# Altium schematic sheet MotorControl_Sch.SchDoc
size B
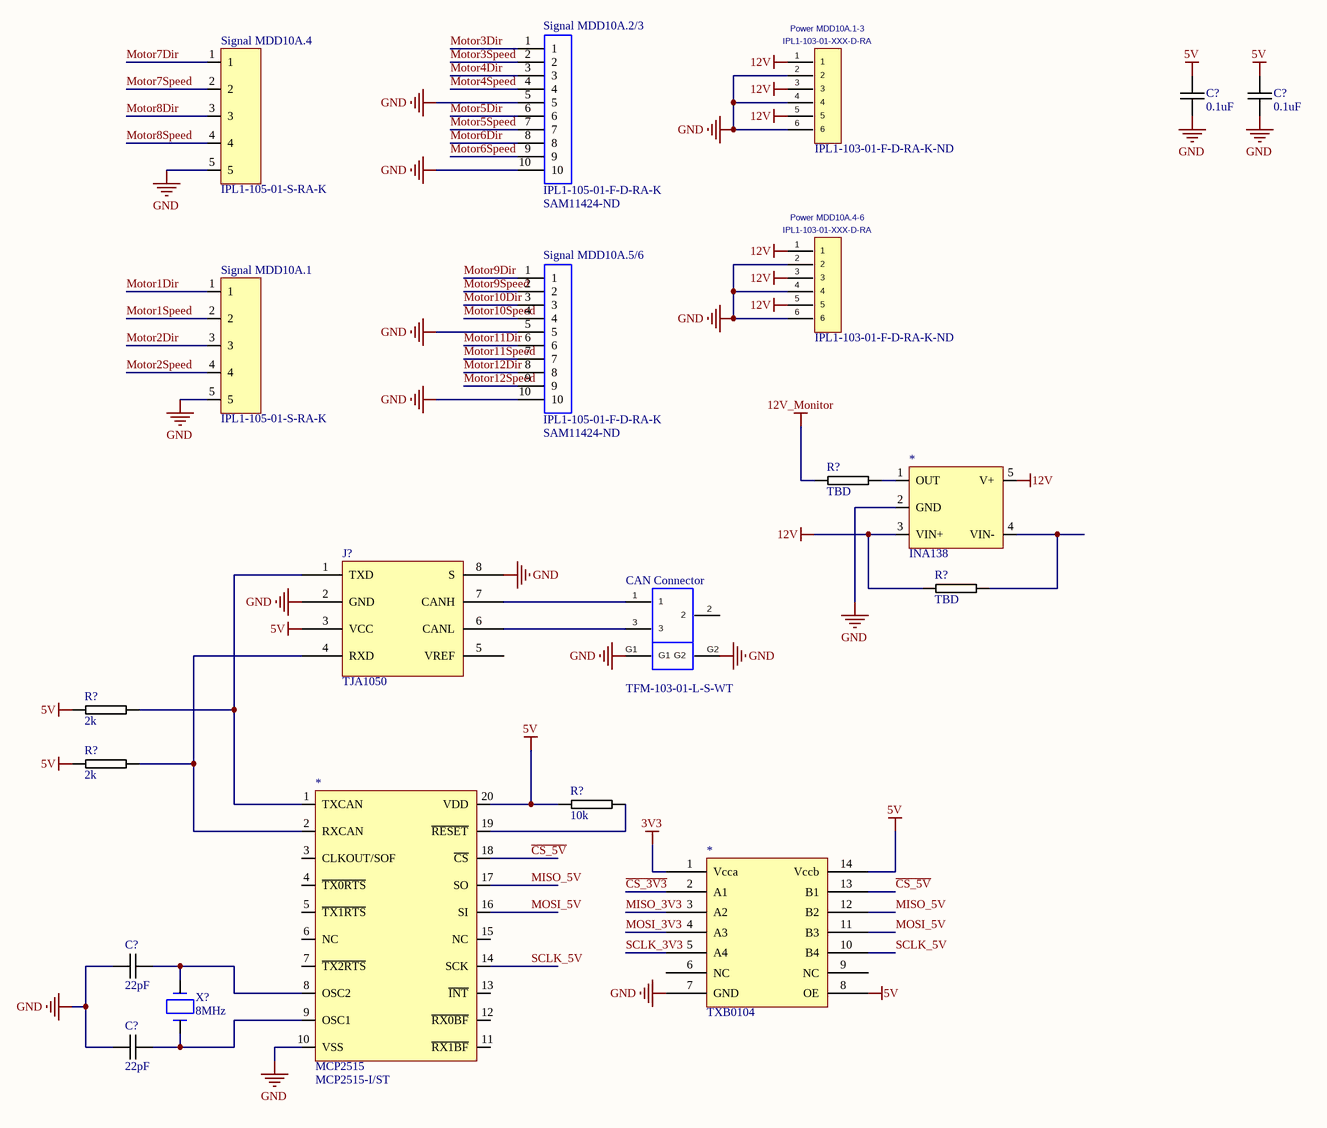
[diagram p0: MotorControl_Sch.SchDoc]

## Parts
(Parts that share a designator on the sheet are numbered #1, #2 ... from top to bottom, then left to right.)
*#1  INA138  [SOT23]
*#2  TXB0104  [TXB0104]
*#3  MCP2515  Supplier Part Number 1: MCP2515-I/ST  [TSSOP20]
C?#1  0.1uF  [0805C-GENERIC]
C?#2  0.1uF  [0805C-GENERIC]
C?#3  22pF  [0805C-GENERIC]
C?#4  22pF  [0805C-GENERIC]
CAN_Connector  TFM-103-01-L-S-WT  [TFM-103-01-L-S-WT]
J?  TJA1050  [TJA1050]
Power_MDD10A.1-3  IPL1-103-01-XXX-D-RA  Supplier Part Number 1: IPL1-103-01-F-D-RA-K-ND  [IPL1-103-01-XXX-D-RA]
Power_MDD10A.4-6  IPL1-103-01-XXX-D-RA  Supplier Part Number 1: IPL1-103-01-F-D-RA-K-ND  [IPL1-103-01-XXX-D-RA]
R?#1  TBD  [0805R-GENERIC]
R?#2  TBD  [0805R-GENERIC]
R?#3  2k  [0805R-GENERIC]
R?#4  2k  [0805R-GENERIC]
R?#5  10k  [0805R-GENERIC]
Signal_MDD10A.1  IPL1-105-01-S-RA-K  [IPL1-105-01-S-RA-K]
Signal_MDD10A.2/3  IPL1-105-01-F-D-RA-K  Supplier Part Number 1: SAM11424-ND  [IPL1-105-01-F-D-RA-K]
Signal_MDD10A.4  IPL1-105-01-S-RA-K  [IPL1-105-01-S-RA-K]
Signal_MDD10A.5/6  IPL1-105-01-F-D-RA-K  Supplier Part Number 1: SAM11424-ND  [IPL1-105-01-F-D-RA-K]
X?  8MHz  [GC0800044]

## Nets
3V3: *#2.1(Vcca)
5V: *#2.8(OE) *#2.14(Vccb) *#3.20(VDD) C?#1.1 C?#2.1 J?.3(VCC) R?#3.1 R?#4.1 R?#5.1
12V: *#1.3(VIN+) *#1.5(V+) Power_MDD10A.1-3.1 Power_MDD10A.1-3.3 Power_MDD10A.1-3.5 Power_MDD10A.4-6.1 Power_MDD10A.4-6.3 Power_MDD10A.4-6.5 R?#2.1
12V_Monitor: R?#1.1
GND: *#1.2(GND) *#2.7(GND) *#3.10(VSS) C?#1.2 C?#2.2 C?#3.1 C?#4.1 CAN_Connector.G1 CAN_Connector.G2 J?.2(GND) J?.8(S) Power_MDD10A.1-3.2 Power_MDD10A.1-3.4 Power_MDD10A.1-3.6 Power_MDD10A.4-6.2 Power_MDD10A.4-6.4 Power_MDD10A.4-6.6 Signal_MDD10A.1.5 Signal_MDD10A.2/3.5 Signal_MDD10A.2/3.10 Signal_MDD10A.4.5 Signal_MDD10A.5/6.5 Signal_MDD10A.5/6.10
~{CS_3V3}: *#2.2(A1)
~{CS_5V}: *#2.13(B1) *#3.18(~{CS})
MISO_3V3: *#2.3(A2)
MISO_5V: *#2.12(B2) *#3.17(SO)
MOSI_3V3: *#2.4(A3)
MOSI_5V: *#2.11(B3) *#3.16(SI)
Motor1Dir: Signal_MDD10A.1.1
Motor1Speed: Signal_MDD10A.1.2
Motor2Dir: Signal_MDD10A.1.3
Motor2Speed: Signal_MDD10A.1.4
Motor3Dir: Signal_MDD10A.2/3.1
Motor3Speed: Signal_MDD10A.2/3.2
Motor4Dir: Signal_MDD10A.2/3.3
Motor4Speed: Signal_MDD10A.2/3.4
Motor5Dir: Signal_MDD10A.2/3.6
Motor5Speed: Signal_MDD10A.2/3.7
Motor6Dir: Signal_MDD10A.2/3.8
Motor6Speed: Signal_MDD10A.2/3.9
Motor7Dir: Signal_MDD10A.4.1
Motor7Speed: Signal_MDD10A.4.2
Motor8Dir: Signal_MDD10A.4.3
Motor8Speed: Signal_MDD10A.4.4
Motor9Dir: Signal_MDD10A.5/6.1
Motor9Speed: Signal_MDD10A.5/6.2
Motor10Dir: Signal_MDD10A.5/6.3
Motor10Speed: Signal_MDD10A.5/6.4
Motor11Dir: Signal_MDD10A.5/6.6
Motor11Speed: Signal_MDD10A.5/6.7
Motor12Dir: Signal_MDD10A.5/6.8
Motor12Speed: Signal_MDD10A.5/6.9
SCLK_3V3: *#2.5(A4)
SCLK_5V: *#2.10(B4) *#3.14(SCK)
Net*#1_1: *#1.1(OUT) R?#1.2
Net*#1_4: *#1.4(VIN-) R?#2.2
Net*#3_1: *#3.1(TXCAN) J?.1(TXD) R?#3.2
Net*#3_2: *#3.2(RXCAN) J?.4(RXD) R?#4.2
Net*#3_8: *#3.8(OSC2) C?#3.2 X?.1
Net*#3_9: *#3.9(OSC1) C?#4.2 X?.2
Net*#3_19: *#3.19(~{RESET}) R?#5.2
NetCAN_Connector_1: CAN_Connector.1 J?.7(CANH)
NetCAN_Connector_3: CAN_Connector.3 J?.6(CANL)

Not connected (* = marked no-connect by the designer): *#2 6(NC) 9(NC); *#3 3(CLKOUT/SOF) 4(~{TX0RTS}) 5(~{TX1RTS}) 6(NC) 7(~{TX2RTS}) 11(~{RX1BF}) 12(~{RX0BF}) 13(~{INT}) 15(NC); CAN_Connector 2; J? 5(VREF)

## Notes on the sheet
- Title
- Size:
- Date:
- B
- Number:
- Time:
- Revision:
- Sheet
- of
- File:

## Library data of the parts
C?#1-C?#4 = 0805C-TBD: CAPACITOR 0805 CERAMIC VALUE TO BE DETERMINED
Power_MDD10A.1-3 Power_MDD10A.4-6 = IPL1-103-01-XXX-D-RA: Terminal Assembly, Double Row, Right Angle, Thru-Hole, 0.100" x 0.100" Pitch, 6Pins; MANUFACTURER: SAMTEC; CREATED: July 16, 2014 - Wendy Xin; PCB DECAL: IPL1-103-01-XXX-D-RA; Supplier 1: Digi-Key
R?#1-R?#5 = 0805R-TBD: RESISTOR 0805 VALUE TO BE DETERMINED
X? = GC0800044: Diodes Incorporated GC0800044; Supplier 1: Digi-Key; Supplier Part Number 1: GC0800044TR-ND
*#3 = MCP2515: Supplier 1: Arrow
Signal_MDD10A.2/3 Signal_MDD10A.5/6 = IPL1-105-01-F-D-RA-K: Supplier 1: Digi-Key